# Altium project Nwatch.PrjPcb
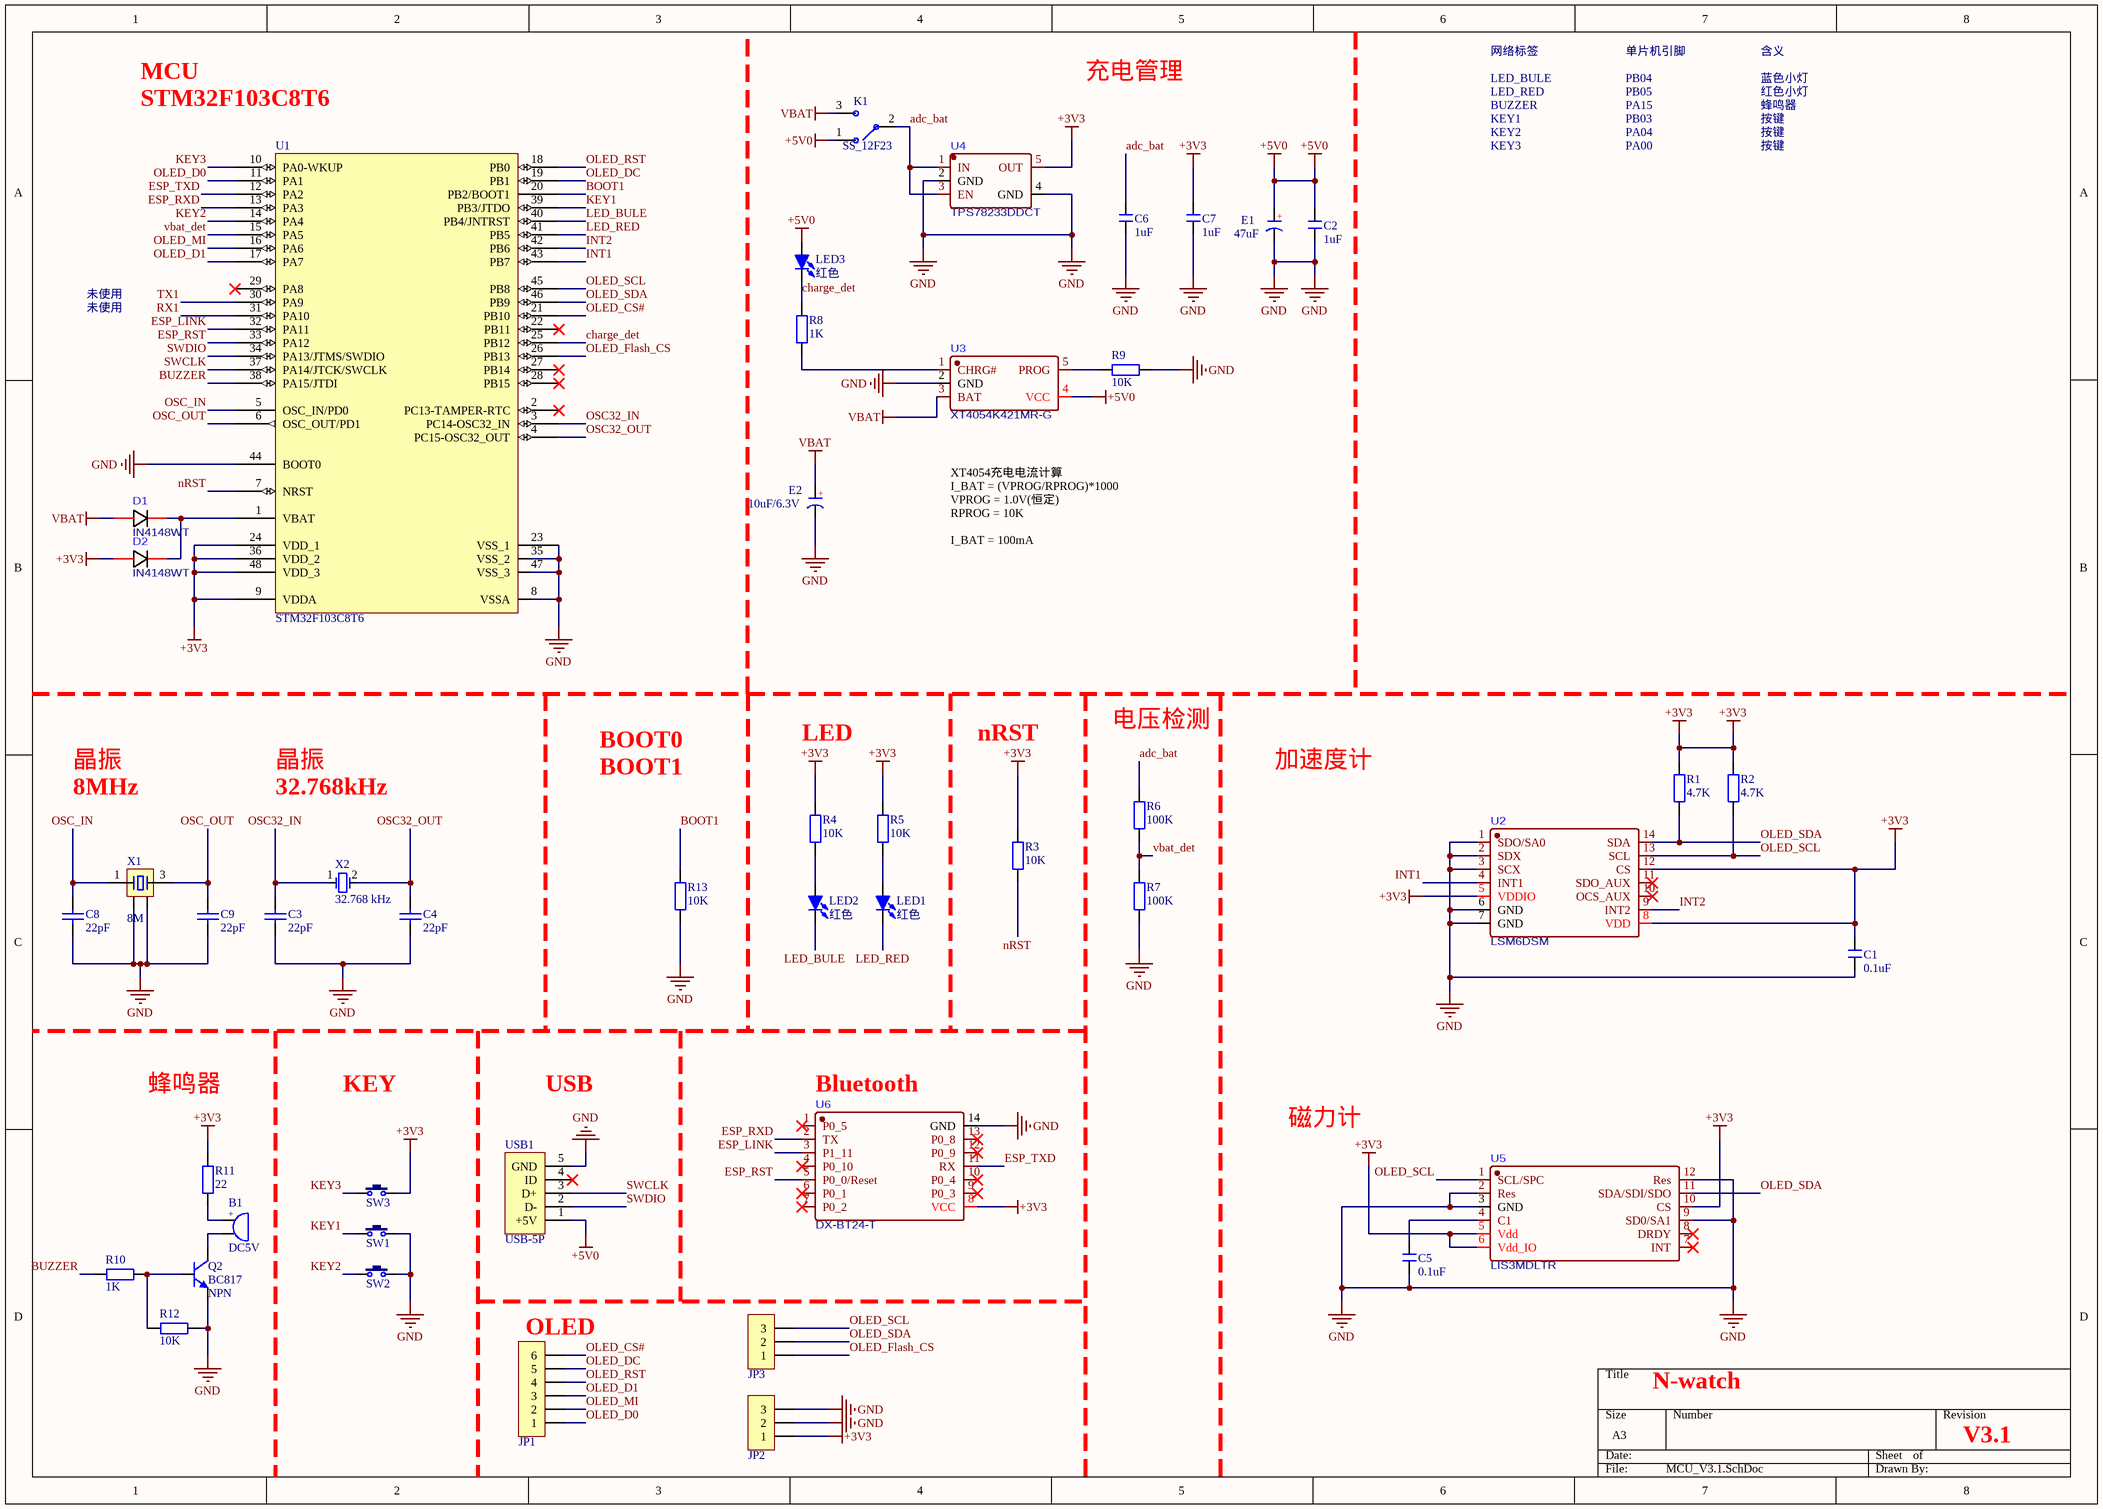
[diagram p0: MCU_V3.1.SchDoc]
1 sheet, 47 parts. Net scope: global (net labels, ports and power ports of the same name join across sheets).
Board file: N-watch_3.1.PcbDoc

## Sheet MCU_V3.1.SchDoc
size A3

### Parts
B1  DC5V  [蜂鸣器5020]
C1  0.1uF  [C 0603]
C2  1uF  [C 0603]
C3  22pF  [C 0603]
C4  22pF  [C 0603]
C5  0.1uF  [C 0603]
C6  1uF  [C 0603]
C7  1uF  [C 0603]
C8  22pF  [C 0603]
C9  22pF  [C 0603]
D1  IN4148WT  [IN4148WT]
D2  IN4148WT  [IN4148WT]
E1  47uF  [CD A(3216)]
E2  10uF/6.3V  [CD A(3216)]
JP1  HDR-1X6  [HDR-1X6]  (value not drawn)
JP2  HDR-1X3  [OLED_3PIN]  (value not drawn)
JP3  HDR-1X3  [OLED_3PIN]  (value not drawn)
K1  SS_12F23  [SS_12F23]
LED1  红色  [LED 0603G]
LED2  红色  [LED 0603G]
LED3  红色  [LED 0603G]
Q2  BC817  [SOT23-3N]
R1  4.7K  [R0603_M]
R2  4.7K  [R0603_M]
R3  10K  [R0603_M]
R4  10K  [R0603_M]
R5  10K  [R0603_M]
R6  100K  [R0603_M]
R7  100K  [R0603_M]
R8  1K  [R0603_M]
R9  10K  [R0603_M]
R10  1K  [R0603_M]
R11  22  [R0603_M]
R12  10K  [R0603_M]
R13  10K  [R0603_M]
SW1  3x6x5  [SB-2*4*3.5]  (value not drawn)
SW2  3x6x5  [SB-2*4*3.5]  (value not drawn)
SW3  3x6x5  [SB-2*4*3.5]  (value not drawn)
U1  STM32F103C8T6  [LQFP48 7X7_N]
U2  LSM6DSM  [LSM6DSM]
U3  XT4054K421MR-G  [SOT-23-5_L3.0-W1.7-P0.95-LS2.8-BR]
U4  TPS78233DDCT  [SOT-23-5_L3.0-W1.7-P0.95-LS2.8-BR]
U5  LIS3MDLTR  [LIS3MDLTR]
U6  DX-BT24-T  [DX-BT24-T]
USB1  USB-5P  [MICRO-USB]
X1  8M  [XTAL-3225]
X2  32.768 kHz  [XTAL-3215]

### Nets
+3V3: C1.2 C7.2 D2.1 JP2.1 R1.2 R2.2 R3.2 R4.2 R5.2 R11.2 SW3.2 U1.9(VDDA) U1.24(VDD_1) U1.36(VDD_2) U1.48(VDD_3) U2.5(VDDIO) U2.8(VDD) U2.12(CS) U4.5(OUT) U5.5(Vdd) U5.6(Vdd_IO) U5.10(CS) U6.8(VCC)
+5V0: C2.2 E1.1(A) K1.1 LED3.1(A) U3.4(VCC) USB1.1(+5V)
GND: C1.1 C2.1 C3.2 C4.2 C5.1 C6.1 C7.1 C8.1 C9.1 E1.2(K) E2.2(K) JP2.2 JP2.3 Q2.2(E) R7.1 R9.1 R12.1 R13.1 SW1.2 SW2.2 U1.8(VSSA) U1.23(VSS_1) U1.35(VSS_2) U1.44(BOOT0) U1.47(VSS_3) U2.1(SDO/SA0) U2.2(SDX) U2.3(SCX) U2.6(GND) U2.7(GND) U3.2(GND) U4.2(GND) U4.4(GND) U5.2(Res) U5.3(GND) U5.9(SD0/SA1) U5.12(Res) U6.14(GND) USB1.5(GND) X1.2 X1.4
VBAT: D1.1 E2.1(A) K1.3 U3.3(BAT)
adc_bat: C6.2 K1.2 R6.2 U4.1(IN) U4.3(EN)
BOOT1: R13.2 U1.20(PB2/BOOT1)
BUZZER: R10.2 U1.38(PA15/JTDI)
charge_det: LED3.2(K) R8.2 U1.25(PB12)
ESP_LINK: U1.32(PA11) U6.3(P1_11)
ESP_RST: U1.33(PA12) U6.5(P0_0/Reset)
ESP_RXD: U1.13(PA3) U6.2(TX)
ESP_TXD: U1.12(PA2) U6.11(RX)
INT1: U1.43(PB7) U2.4(INT1)
INT2: U1.42(PB6) U2.9(INT2)
KEY1: SW1.1 U1.39(PB3/JTDO)
KEY2: SW2.1 U1.14(PA4)
KEY3: SW3.1 U1.10(PA0-WKUP)
LED_BULE: LED2.2(K) U1.40(PB4/JNTRST)
LED_RED: LED1.2(K) U1.41(PB5)
nRST: R3.1 U1.7(NRST)
OLED_CS#: JP1.6 U1.21(PB10)
OLED_D0: JP1.1 U1.11(PA1)
OLED_D1: JP1.3 U1.17(PA7)
OLED_DC: JP1.5 U1.19(PB1)
OLED_Flash_CS: JP3.1 U1.26(PB13)
OLED_MI: JP1.2 U1.16(PA6)
OLED_RST: JP1.4 U1.18(PB0)
OLED_SCL: JP3.3 R2.1 U1.45(PB8) U2.13(SCL) U5.1(SCL/SPC)
OLED_SDA: JP3.2 R1.1 U1.46(PB9) U2.14(SDA) U5.11(SDA/SDI/SDO)
OSC32_IN: C3.1 U1.3(PC14-OSC32_IN) X2.1(OSC1)
OSC32_OUT: C4.1 U1.4(PC15-OSC32_OUT) X2.2(OSC2)
OSC_IN: C8.2 U1.5(OSC_IN/PD0) X1.1
OSC_OUT: C9.2 U1.6(OSC_OUT/PD1) X1.3
RX1: U1.31(PA10)
SWCLK: U1.37(PA14/JTCK/SWCLK) USB1.3(D+)
SWDIO: U1.34(PA13/JTMS/SWDIO) USB1.2(D-)
TX1: U1.30(PA9)
vbat_det: R6.1 R7.2 U1.15(PA5)
NetB1_1: B1.1 R11.1
NetB1_2: B1.2 Q2.3(C)
NetC5_2: C5.2 U5.4(C1)
NetD1_2: D1.2 D2.2 U1.1(VBAT)
NetLED1_1: LED1.1(A) R5.1
NetLED2_1: LED2.1(A) R4.1
NetQ2_1: Q2.1(B) R10.1 R12.2
NetR8_1: R8.1 U3.1(CHRG#)
NetR9_2: R9.2 U3.5(PROG)

Not connected (* = marked no-connect by the designer): U1 2(PC13-TAMPER-RTC)* 22(PB11)* 27(PB14)* 28(PB15)* 29(PA8)*; U2 10(OCS_AUX)* 11(SDO_AUX)*; U5 7(INT)* 8(DRDY)*; U6 1(P0_5)* 4(P0_10)* 6(P0_1)* 7(P0_2)* 9(P0_3)* 10(P0_4)* 12(P0_9)* 13(P0_8)*; USB1 4(ID)*

### Notes on the sheet
- MCU
- STM32F103C8T6
- 充电管理
- LED_RED
- 网络标签
- LED_BULE
- BUZZER
- PB04
- 单片机引脚
- PB05
- PA15
- 蓝色小灯
- 含义
- 红色小灯
- 蜂鸣器
- KEY1
- KEY2
- KEY3
- PB03
- PA04
- PA00
- 按键
- 未使用
- XT4054充电电流计算
  I_BAT = (VPROG/RPROG)*1000
  VPROG = 1.0V(恒定)
  RPROG = 10K
  I_BAT = 100mA
- 晶振
- BOOT0
- BOOT1
- LED
- nRST
- 电压检测
- 加速度计
- 8MHz
- 32.768kHz
- KEY
- USB
- (near U6) Bluetooth
- 磁力计
- (near Q2) NPN
- (near JP1) OLED
- N-watch
- V3.1
- (in symbol BEEP) +
- (in symbol C-CD) +

### Library data of the parts
B1 = BEEP: 蜂鸣器; 版权归属: 黎明电子style; BOM名称: 蜂鸣器; 学习资源: https://lmdzstyle.taobao.com/
C1 C2 C5-C7 = C: 无极性贴片电容; 版权归属: 黎明电子style; BOM名称: 无极性贴片电容; 学习资源: https://lmdzstyle.taobao.com/
C3 C4 C8 C9 = C: 贴片电容/MLCC电容; BOM名称: 无极性贴片电容; 当前库版本V2022.11.14 @淘宝卖家:黄晶宝石: 最新版本发布https://shop463601444.taobao.com
E1 E2 = C-CD: 贴片钽电容; 版权归属: 黎明电子style; BOM名称: 贴片钽电容; 学习资源: https://lmdzstyle.taobao.com/
JP1 = Header 6: 6P接插件; 版权归属: 黎明电子style; BOM名称: 6P接插件; 学习资源: https://lmdzstyle.taobao.com/
JP2 JP3 = Header 3: 3P接插件; 版权归属: 黎明电子style; BOM名称: 3P接插件; 学习资源: https://lmdzstyle.taobao.com/
LED1-LED3 = LED-SMD: 贴片LED; 版权归属: 黎明电子style; BOM名称: 贴片LED; 学习资源: https://lmdzstyle.taobao.com/
Q2 = 8050-SMD: 高频放大-NPN型; 版权归属: 黎明电子style; 属性: 40V 1.5A 1W 100MHZ; BOM名称: 高频放大-NPN型; 学习资源: https://lmdzstyle.taobao.com/
R1-R13 = R: 贴片电阻; 联系下单店铺卖家 免费帮你查找封装: 联系下单店铺卖家 免费技术支持; BOM名称: 贴片电阻
SW1-SW3 = TSW 3x6: 3x6轻触开关; 版权归属: 黎明电子style; BOM名称: 3x6轻触开关; 学习资源: https://lmdzstyle.taobao.com/
U1 = STM32F103C8T6: Flaah:64/RAM:20/IO:36; 版权归属: 黎明电子style; 学习资源: https://lmdzstyle.taobao.com/
USB1 = USB-5P: 微型USB母座; 版权归属: 黎明电子style; BOM名称: 微型USB母座; 学习资源: https://lmdzstyle.taobao.com/
X1 = XTAL-4: 4脚晶振; 版权归属: 源创客; BOM名称: 4脚晶振; 学习资源: www.ooocke.com
X2 = XTAL: Crystal Oscillator; Published: 8-Jun-2000; LatestRevisionDate: 17-Jul-2002; LatestRevisionNote: Re-released for DXP Platform.; PackageReference: R38; Publisher: Altium Limited; PackageDescription: Crystal, Thru-Hole; 2 Leads; Body 3.1 x 8.2 mm (Dia.xH)